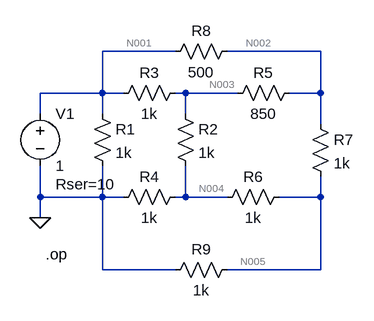
[diagram p0: schematic basic eevblog example.asc]
basic eevblog example.asc, the LTspice schematic file:
Version 4
SHEET 1 880 680
WIRE 240 -16 128 -16
WIRE 416 -16 320 -16
WIRE 464 -16 416 -16
WIRE 128 48 128 -16
WIRE 128 48 32 48
WIRE 160 48 128 48
WIRE 256 48 240 48
WIRE 288 48 256 48
WIRE 336 48 288 48
WIRE 464 48 464 -16
WIRE 464 48 416 48
WIRE 32 80 32 48
WIRE 128 80 128 48
WIRE 256 80 256 48
WIRE 464 96 464 48
WIRE 32 208 32 160
WIRE 128 208 128 160
WIRE 128 208 32 208
WIRE 160 208 128 208
WIRE 256 208 256 160
WIRE 256 208 240 208
WIRE 272 208 256 208
WIRE 320 208 272 208
WIRE 464 208 464 176
WIRE 464 208 400 208
WIRE 32 240 32 208
WIRE 128 320 128 208
WIRE 240 320 128 320
WIRE 400 320 320 320
WIRE 464 320 464 208
WIRE 464 320 400 320
FLAG 32 240 0
DATAFLAG 288 48 ""
DATAFLAG 416 -16 ""
DATAFLAG 400 320 ""
DATAFLAG 272 208 ""
DATAFLAG 592 144 "I(R7)"
DATAFLAG 384 112 "V(n005)*I(R5)"
SYMBOL res 112 64 R0
SYMATTR InstName R1
SYMATTR Value 1k
SYMBOL res 240 64 R0
SYMATTR InstName R2
SYMATTR Value 1k
SYMBOL res 144 64 R270
WINDOW 0 32 56 VTop 2
WINDOW 3 0 56 VBottom 2
SYMATTR InstName R3
SYMATTR Value 1k
SYMBOL res 256 192 R90
WINDOW 0 0 56 VBottom 2
WINDOW 3 32 56 VTop 2
SYMATTR InstName R4
SYMATTR Value 1k
SYMBOL res 320 64 R270
WINDOW 0 32 56 VTop 2
WINDOW 3 0 56 VBottom 2
SYMATTR InstName R5
SYMATTR Value 850
SYMBOL res 416 192 R90
WINDOW 0 0 56 VBottom 2
WINDOW 3 32 56 VTop 2
SYMATTR InstName R6
SYMATTR Value 1k
SYMBOL res 448 80 R0
SYMATTR InstName R7
SYMATTR Value 1k
SYMBOL voltage 32 64 R0
WINDOW 123 0 0 Left 2
WINDOW 39 24 124 Left 2
SYMATTR InstName V1
SYMATTR Value 1
SYMATTR SpiceLine Rser=10
SYMBOL res 224 0 R270
WINDOW 0 32 56 VTop 2
WINDOW 3 0 56 VBottom 2
SYMATTR InstName R8
SYMATTR Value 500
SYMBOL res 336 304 R90
WINDOW 0 0 56 VBottom 2
WINDOW 3 32 56 VTop 2
SYMATTR InstName R9
SYMATTR Value 1k
TEXT 40 296 Left 2 !.op

The netlist it stands for:
* basic eevblog example.asc
R1 N001 0 1k
R2 N003 N004 1k
R3 N001 N003 1k
R4 N004 0 1k
R5 N003 N002 850
R6 N005 N004 1k
R7 N002 N005 1k
V1 N001 0 1 Rser=10
R8 N001 N002 500
R9 N005 0 1k
.op
.backanno
.end

* Results of the author's LTspice run, read from the files saved beside the schematic
* Operating Point:
*   V(n001) = 982.9 mV
*   V(n003) = 702.9 mV
*   V(n004) = 358.3 mV
*   V(n002) = 757.7 mV
*   V(n005) = 372 mV
*   I(R9) = 372 µA
*   I(R8) = 450.3 µA
*   I(R7) = 385.7 µA
*   I(R6) = 13.72 µA
*   I(R5) = -64.56 µA
*   I(R4) = 358.3 µA
*   I(R3) = 280 µA
*   I(R2) = 344.6 µA
*   I(R1) = 982.9 µA
*   I(V1) = -1.713 mA